# Altium schematic sheet nm_pwr_single_ch.SchDoc: =GlobalProjectName
size 209 x 297 mm; SheetNumber: 4; SheetTotal: 9; PageSetup: Record=PageOptions|CenterHorizontal=True|CenterVertical=True|PrintScale=1.00|XCorrection=1.00|YCorrection=1.00|PrintKind=1|BorderSize=5000000|LeftOffset=0|BottomOffset=0|Orientation=2|PaperLength=1000|PaperWidth=1000|Scale=100|PaperSource=15|PrintQuality=1200|MediaType=1|DitherType=10|PaperKind=A3|PrintScaleMode=1; Weight: -; ScaleFactor: -
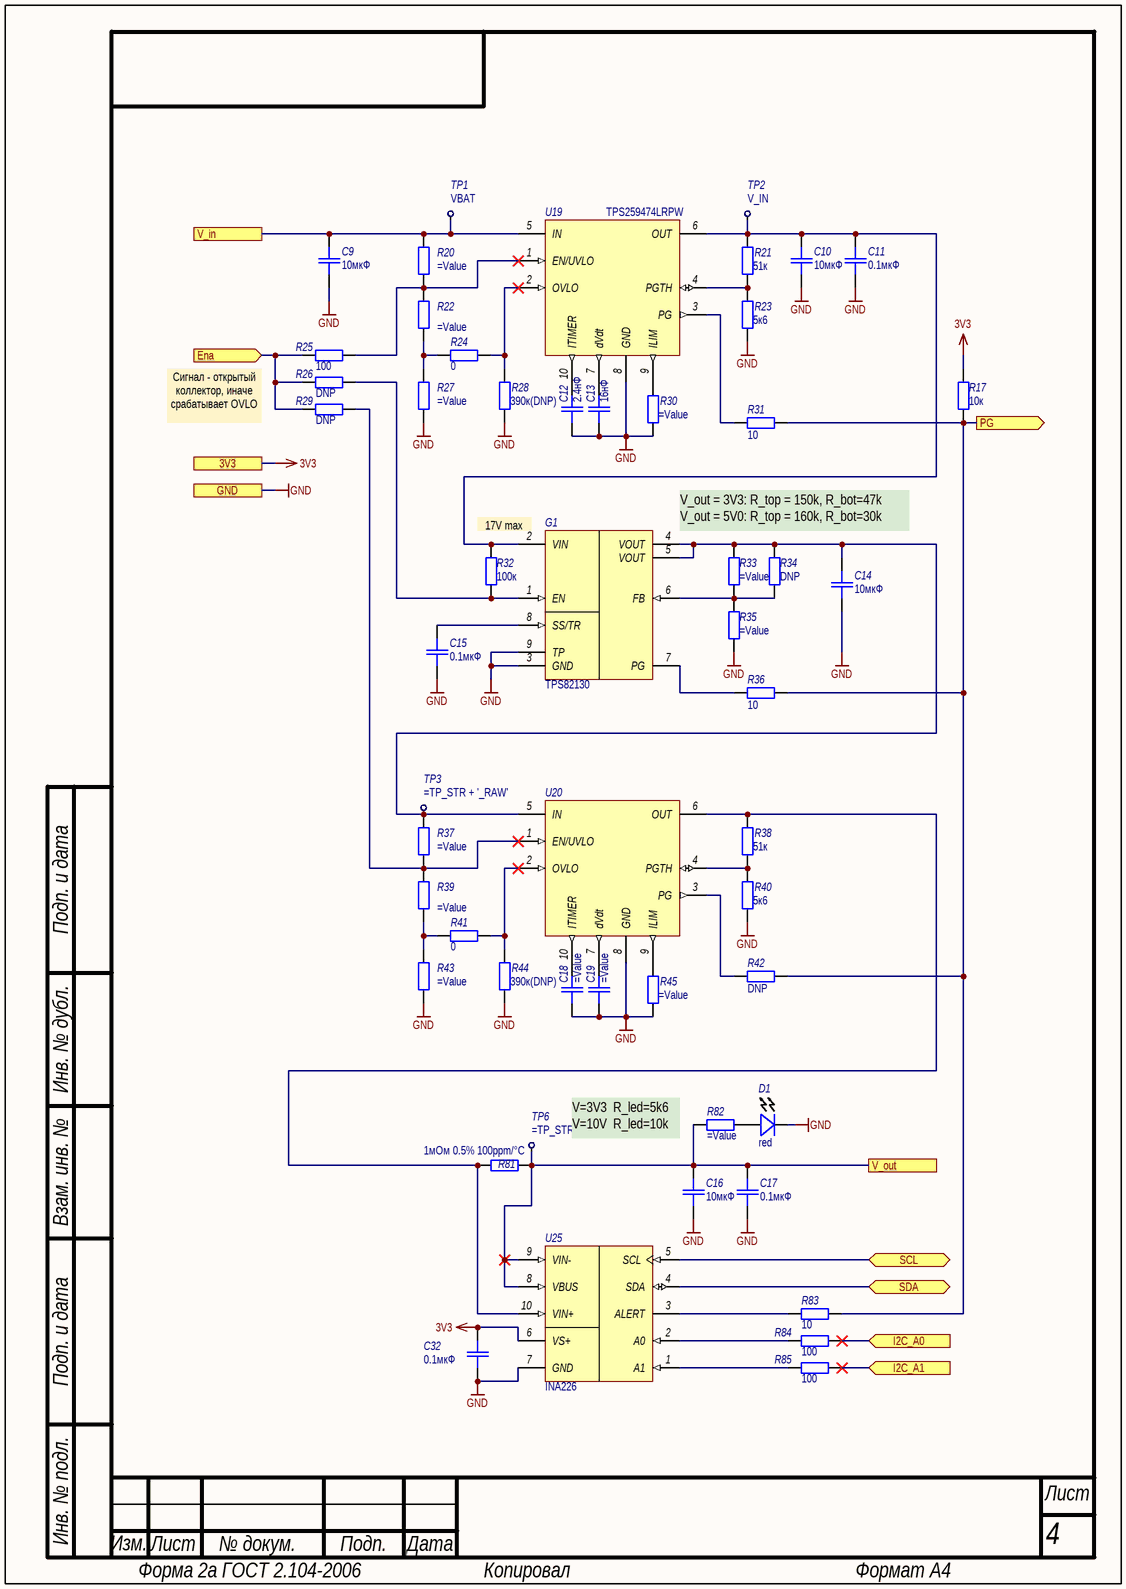
[diagram p0: nm_pwr_single_ch.SchDoc]

## Parts
C9  value 10мкФ  [SMD_C0603]  (hidden comment: Capacitor)
C10  value 10мкФ  [SMD_C0603]  (hidden comment: Capacitor)
C11  value 0.1мкФ  [SMD_C0603]  (hidden comment: Capacitor)
C12  2.4нФ  [SMD_C0603]
C13  16нФ  [SMD_C0603]
C14  value 10мкФ  [SMD_C0603]  (hidden comment: Capacitor)
C15  value 0.1мкФ  [SMD_C0603]  (hidden comment: Capacitor)
C16  value 10мкФ  [SMD_C0603]  (hidden comment: Capacitor)
C17  value 0.1мкФ  [SMD_C0603]  (hidden comment: Capacitor)
C18  (no value)  [SMD_C0603]
C19  (no value)  [SMD_C0603]
C32  0.1мкФ  [SMD_C0603]
D1  value red  [LED_0603]  (hidden comment: LED)
G1  TPS82130  [uSiL-8]
R17  10к  [SMD_0603]
R20  (no value)  [SMD_0603]
R21  51к  [SMD_0603]
R22  (no value)  [SMD_0603]
R23  5к6  [SMD_0603]
R24  0  [SMD_0603]
R25  100  [SMD_0603]
R26  value DNP  [SMD_0603]  (hidden comment: Resistor)
R27  (no value)  [SMD_0603]
R28  390к(DNP)  [SMD_0603]
R29  value DNP  [SMD_0603]  (hidden comment: Resistor)
R30  (no value)  [SMD_0603]
R31  10  [SMD_0603]
R32  value 100к  [SMD_0603]  (hidden comment: Resistor)
R33  (no value)  [SMD_0603]
R34  DNP  [SMD_0603]
R35  (no value)  [SMD_0603]
R36  10  [SMD_0603]
R37  (no value)  [SMD_0603]
R38  51к  [SMD_0603]
R39  (no value)  [SMD_0603]
R40  5к6  [SMD_0603]
R41  0  [SMD_0603]
R42  DNP  [SMD_0603]
R43  (no value)  [SMD_0603]
R44  390к(DNP)  [SMD_0603]
R45  (no value)  [SMD_0603]
R81  1мОм 0.5% 100ppm/°C  [SMD_1206]
R82  (no value)  [SMD_0603]
R83  10  [SMD_0603]
R84  100  [SMD_0603]
R85  100  [SMD_0603]
TP1  VBAT  [TP_PAD_1]  (no BOM)
TP2  V_IN  [TP_PAD_1]  (no BOM)
TP3  (no value)  [TP_PAD_1]  (no BOM)
TP6  (no value)  [TP_PAD_1]  (no BOM)
U19  Наименование: TPS259474LRPW  [VQFN-HR-10]  (hidden comment: TPS25947x)
U20  TPS25947x  [VQFN-HR-10]  (value not drawn)
U25  INA226  [VSSOP-10]

## Ports
3V3, Ena (in), GND, I2C_A0 (in), I2C_A1 (in), PG (out), SCL (bidir), SDA (bidir), V_in, V_out

## Nets
3V3: C32.2 R17.2 U25.6(VS+) ; port 3V3
GND: C9.1 C10.1 C11.1 C12.1 C13.1 C14.1 C15.1 C16.1 C17.1 C18.1 C19.1 C32.1 D1.2(K) G1.3(GND) G1.9(TP) R23.1 R27.1 R28.1 R30.1 R35.2 R40.1 R43.1 R44.1 R45.1 U19.8(GND) U20.8(GND) U25.7(GND) ; port GND
Ena: R25.2 R26.2 R29.2 ; port Ena
I2C_A0: R84.1 ; port I2C_A0
I2C_A1: R85.1 ; port I2C_A1
PG: R17.1 R31.1 R36.1 R42.1 R83.1 ; port PG
SCL: U25.5(SCL) ; port SCL
SDA: U25.4(SDA) ; port SDA
V_in: C9.2 R20.2 TP1.0(TP) U19.5(IN) ; port V_in
V_out: C16.2 C17.2 R81.1 R82.1 TP6.0(TP) U25.8(VBUS) U25.9(VIN-) ; port V_out
NetC10_2: C10.2 C11.2 G1.2(VIN) R21.2 R32.1 TP2.0(TP) U19.6(OUT)
NetC12_2: C12.2 U19.10(ITIMER)
NetC13_2: C13.2 U19.7(dVdt)
NetC14_2: C14.2 G1.4(VOUT) G1.5(VOUT) R33.1 R34.1 R37.2 TP3.0(TP) U20.5(IN)
NetC15_2: C15.2 G1.8(SS/TR)
NetC18_2: C18.2 U20.10(ITIMER)
NetC19_2: C19.2 U20.7(dVdt)
NetD1_1: D1.1(A) R82.2
NetG1_1: G1.1(EN) R26.1 R32.2
NetG1_6: G1.6(FB) R33.2 R34.2 R35.1
NetG1_7: G1.7(PG) R36.2
NetR20_1: R20.1 R22.2 R25.1 U19.1(EN/UVLO)
NetR21_1: R21.1 R23.2 U19.4(PGTH)
NetR22_1: R22.1 R24.2 R27.2
NetR24_1: R24.1 R28.2 U19.2(OVLO)
NetR29_1: R29.1 R37.1 R39.2 U20.1(EN/UVLO)
NetR30_2: R30.2 U19.9(ILIM)
NetR31_2: R31.2 U19.3(PG)
NetR38_1: R38.1 R40.2 U20.4(PGTH)
NetR38_2: R38.2 R81.2 U20.6(OUT) U25.10(VIN+)
NetR39_1: R39.1 R41.2 R43.2
NetR41_1: R41.1 R44.2 U20.2(OVLO)
NetR42_2: R42.2 U20.3(PG)
NetR45_2: R45.2 U20.9(ILIM)
NetR83_2: R83.2 U25.3(ALERT)
NetR84_2: R84.2 U25.2(A0)
NetR85_2: R85.2 U25.1(A1)

## Notes on the sheet
- Сигнал - открытый коллектор, иначе срабатывает OVLO
- 17V max
- V_out = 3V3: R_top = 150k, R_bot=47k
  V_out = 5V0: R_top = 160k, R_bot=30k
- V=3V3  R_led=5k6
  V=10V  R_led=10k
- Подп. и дата
- Инв. № дубл.
- Взам. инв. №
- Инв. № подл.
- Изм.
- Лист
- № докум.
- Подп.
- Дата
- Форма 2а ГОСТ 2.104-2006
- Копировал
- Формат А4

## Library data of the parts
C9-C19 = Capacitor: Назначение: SMD-конденсатор; Наименование: Конденсатор; Потребление, Вт: 0; Точность: %; Напряжение: В; Диэлектрик: *; Place_v1: *; Place_v2: *
  C12: Value: 2.4нФ
  C13: Value: 16нФ
  C18: Value: =C_efuse2_itimer
  C19: Value: =C_efuse2_dVdT
C32 = Capacitor: Назначение: SMD-конденсатор; Наименование: Конденсатор; Потребление, Вт: 0; Value: 0.1мкФ; Place_v1: *; Place_v2: *
D1 = LED: Назначение: Светодиод; Наименование: SMD-LED; Потребление, Вт: 0,01; Place_v1: *; Place_v2: *
G1 = TPS82130: 17-V Input 3-A Step-Down Converter MicroSiP™ Module with Integrated Inductor; Потребление, Вт: 1,0; ComponentLink1Description: Data sheet; ComponentLink1URL: http://www.ti.com/lit/ds/symlink/tps82130.pdf; Назначение: 17-V Input 3-A Step-Down Converter MicroSiP™ Module with Integrated Inductor; DataSheet: https://www.ti.com/lit/ds/symlink/tps82130.pdf?ts=1592813288219&ref_url=https%253A%252F%252Fwww.google.com%252F; Supplier 1: Digi-Key; Supplier Part Number 1: 296-43922-1-ND; Наименование: TPS82130; Place_v1: =PL_V_REG_PLACE; Place_v2: =PL_V_REG_PLACE
R17 = Resistor: Наименование: Резистор; Назначение: SMD-резистор; Потребление, Вт: 0,001; Описание: Резистор 0603 10K ±1% 100ppm/°C; Value: 10к; Place_v1: *; Place_v2: *
R20-R25 R27 R28 R30 R31 R33-R44 R82-R85 = Resistor: Наименование: Резистор; Назначение: SMD-резистор; Потребление, Вт: 0,001; Place_v1: *; Place_v2: *
  R20: Value: =R_efuse1_top
  R21 R38: Value: 51к
  R22: Value: =R_efuse1_mid
  R23 R40: Value: 5к6
  R24 R41: Value: 0
  R25 R84 R85: Value: 100
  R27: Value: =R_efuse1_bot
  R28 R44: Value: 390к(DNP)
  R30: Value: =R_efuse1_ilim
  R31 R36 R83: Value: 10
  R33: Value: =R1_Value
  R34 R42: Value: DNP
  R35: Value: =R2_Value
  R37: Value: =R_efuse2_top
  R39: Value: =R_efuse2_mid
  R43: Value: =R_efuse2_bot
  R82: Value: =R_pwr_led
R26 R29 R32 = Resistor: Наименование: Резистор; Назначение: SMD-резистор; Потребление, Вт: 0,001; Точность: %; Place_v1: *; Place_v2: *
R45 = Resistor: Назначение: SMD-резистор; Потребление, Вт: 0,001; Value: =R_efuse2_ilim; Place_v1: *; Place_v2: *
R81 = Resistor: PE1206DRM470R01L; Наименование: Резистор; Назначение: SMD-резистор; Потребление, Вт: 0,001; Value: 1мОм 0.5% 100ppm/°C; Place_v1: *; Place_v2: *
TP1-TP3 TP6 = TP: Наименование: Точка проверки; Назначение: Контроль параметров платы; Place_v1: *; Place_v2: *
  TP1: TP_Name: VBAT
  TP2: TP_Name: V_IN
  TP3: TP_Name: =TP_STR + '_RAW'
  TP6: TP_Name: =TP_STR + '_OUT'
U19 = TPS25947x: TPS25947xx, 2.7 - 23 V, 5.5 A, 28-mΩ True Reverse Current Blocking eFuse with Input / Reverse Polarity Protection; Потребление, Вт: 0,05; Назначение: 2.7 - 23 V, 5.5 A, 28-mΩ True Reverse Current Blocking eFuse with Input; ComponentLink1Description: DataSheet; ComponentLink1URL: https://www.ti.com/lit/ds/symlink/tps25947.pdf?ts=1621925066842&ref_url=https%253A%252F%252Fwww.ti.com%252Fproduct%252FTPS25947%253FkeyMatch%253DTPS25947%2526tisearch%253Dsearch-everything%2526usecase%253DGPN; Place_v1: =PL_E_Fuse_PLACE; Place_v2: =PL_E_Fuse_PLACE
U20 = TPS25947x: TPS25947xx, 2.7 - 23 V, 5.5 A, 28-mΩ True Reverse Current Blocking eFuse with Input / Reverse Polarity Protection; Наименование: TPS259474LRPW; Потребление, Вт: 0,05; Назначение: 2.7 - 23 V, 5.5 A, 28-mΩ True Reverse Current Blocking eFuse with Input; ComponentLink1Description: DataSheet; ComponentLink1URL: https://www.ti.com/lit/ds/symlink/tps25947.pdf?ts=1621925066842&ref_url=https%253A%252F%252Fwww.ti.com%252Fproduct%252FTPS25947%253FkeyMatch%253DTPS25947%2526tisearch%253Dsearch-everything%2526usecase%253DGPN; Place_v1: =PL_E_Fuse_PLACE; Place_v2: =PL_E_Fuse_PLACE
U25 = INA226: High- or Low-Side Measurement, Bidirectional Current and Power Monitor With I2C Interface; Назначение: High-Side or Low-Side Measurement,; Потребление, Вт: 0,001; ComponentLink1Description: Data sheet; ComponentLink1URL: http://www.ti.com/lit/ds/symlink/ina226.pdf; DataSheet: https://www.ti.com/lit/ds/symlink/ina226.pdf?ts=1592809211957&ref_url=https%253A%252F%252Fwww.google.com%252F; Наименование: INA226; Place_v1: =PL_E_Fuse_PLACE; Place_v2: =PL_E_Fuse_PLACE